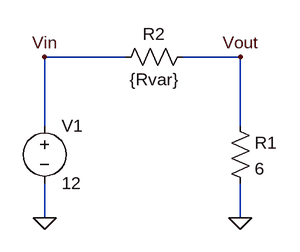
[diagram p0: schematic aufgabe1.asc]
aufgabe1.asc, the LTspice schematic file:
Version 4
SHEET 1 880 680
WIRE 176 48 64 48
WIRE 336 48 256 48
WIRE 64 144 64 48
WIRE 336 144 336 48
WIRE 64 272 64 224
WIRE 336 272 336 224
FLAG 64 272 0
FLAG 336 272 0
FLAG 336 48 Vout
FLAG 64 48 Vin
SYMBOL voltage 64 128 R0
SYMATTR InstName V1
SYMATTR Value 12
SYMBOL res 320 128 R0
SYMATTR InstName R1
SYMATTR Value 6
SYMBOL res 272 32 R90
WINDOW 0 0 56 VBottom 2
WINDOW 3 32 56 VTop 2
SYMATTR InstName R2
SYMATTR Value {Rvar}

The netlist it stands for:
* aufgabe1.asc
V1 Vin 0 12
R1 Vout 0 6
R2 Vout Vin {Rvar}
.backanno
.end